# Altium schematic sheet MISC.SchDoc
size A4; SheetNumber: 2; SheetTotal: 2
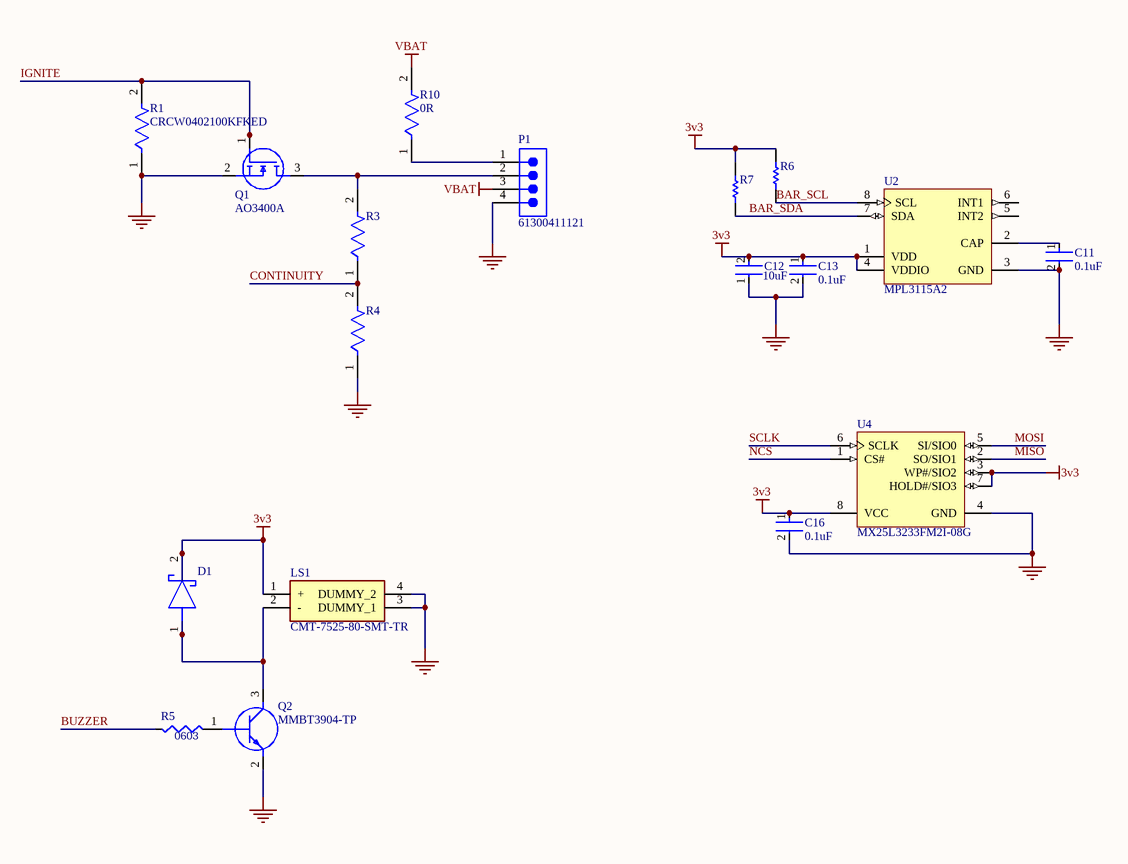
[diagram p0: MISC.SchDoc]

## Parts
C11  0.1uF  [FP-C0402-BB-MFG]
C12  10uF  [FP-C1608-080-0_1-MFG]
C13  0.1uF  [FP-C0402-BB-MFG]
C16  0.1uF  [FP-C0402-BB-MFG]
D1  RB161QS-40T18R  [RB161QS40T18R]  (value not drawn)
LS1  CMT-7525-80-SMT-TR  [CMT752580SMTTR]
P1  61300411121  [61300411121]
Q1  AO3400A  [SOT95P280X125-3N]
Q2  MMBT3904-TP  [SOT95P237X125-3N]
R1  CRCW0402100KFKED  [FP-CRCW0402-e3-IPC_C]
R3  CRCW0402100KFKED  [FP-CRCW0402-e3-IPC_C]  (value not drawn)
R4  CRCW040250K0FKED  [FP-CRCW0402-e3-IPC_A]  (value not drawn)
R5  ERJ-3EKF2000V  [R0603]  (value not drawn)
R6  RC0402JR-074K7L  [RESC1005X40X25LL05T10]  (value not drawn)
R7  RC0402JR-074K7L  [RESC1005X40X25LL05T10]  (value not drawn)
R10  0R  [FP-RK73Z1J-MFG]
U2  MPL3115A2  [FRES-2153-01_V]
U4  MX25L3233FM2I-08G  [MXIC-SOP-8_M]

## Nets
3v3: C12.2 C13.1 C16.1 D1.2(K) LS1.1(+) R6.2 R7.2 U2.1(VDD) U2.4(VDDIO) U4.3(WP#/SIO2) U4.7(HOLD#/SIO3) U4.8(VCC)
GND: C11.2 C12.1 C13.2 C16.2 LS1.3(DUMMY_1) LS1.4(DUMMY_2) P1.4 Q1.2(S) Q2.2(E) R1.1 R4.1 U2.3(GND) U4.4(GND)
VBAT: P1.3 R10.2
BAR_SCL: R6.1 U2.8(SCL)
BAR_SDA: R7.1 U2.7(SDA)
BUZZER: R5.1
CONTINUITY: R3.1 R4.2
IGNITE: Q1.1(G) R1.2
MISO: U4.2(SO/SIO1)
MOSI: U4.5(SI/SIO0)
NCS: U4.1(CS#)
SCLK: U4.6(SCLK)
NetC11_1: C11.1 U2.2(CAP)
NetD1_1: D1.1(A) LS1.2(-) Q2.3(C)
NetP1_1: P1.1 R10.1
NetP1_2: P1.2 Q1.3(D) R3.2
NetQ2_1: Q2.1(B) R5.2

Not connected (* = marked no-connect by the designer): U2 5(INT2) 6(INT1)

## Notes on the sheet
- (in symbol CMP-024-000031-1) 0603

## Library data of the parts
C11 C13 C16 = CMP-2008-02046-2: CAP CER 0.1UF 10V X5R 0402; Manufacturer: Kemet; Manufacturer Part Number: C0402C104K8PACTU; Material: Ceramic; Capacitance: 0.10 μF; Temperature Coefficient: 15%; Tolerance: 0.1; Value: 0.10 μF; Package: C0402-BB; Temperature: -55°C to +125°C; ComponentLink2Description: Datasheet; Temperature Characteristic: X5R; Device Class L1: Passive Components; Height: 0.55mm; Lead Free: Yes; ComponentLink2URL: https://content.kemet.com/datasheets/KEM_C1002_X7R_SMD.pdf; Device Class L2: Capacitors; Temperature Range Low: -55°C; Temperature Range High: +125°C; RoHS: TRUE; Octopart: https://octopart.com/c0402c104k8pactu-kemet-140039; Automotive: No; Mouser Description: Capacitor 100 nF 10 VDC 0402; Category: Cap; Voltage Rating: 10 V; Digikey Description: CAP CER 0.1UF 10V X5R 0402; Ipc Land Pattern Name: CAPC10050X50; Device Class L3: Ceramic Capacitors
C12 = CMP-2000-04979-3: Multilayer Ceramic Capacitors 10μF ±10% 10V X5R SMD 0603; Dielectric Material: Ceramic; Construction: Flat; Height: 0.8mm; Thickness: 0.035inch; Case Code (Metric): 1608; Radiation Hardening: No; Number of Pins: 2; Voltage Rating (DC): 10V; Depth: 0.8mm; Voltage: 10V; RoHS Compliant: Yes; Voltage Rating: 10V; Package Quantity: 1; Resistor Type: Ceramic; Termination: SMD/SMT; Lead Free: Lead Free; REACH SVHC: No SVHC; Tolerance: 10%; Mount: Surface Mount; Series: C; Packaging: Tape and Reel; Width: 0.8mm; Dielectric: X5R; Weight: 7.1E-05oz; Length: 1.6mm; Max Operating Temperature: 85°C; Case Code (Imperial): 0603; Case/Package: 0603; Min Operating Temperature: -55°C; Capacitance: 10uF
D1 = RB161QS-40T18R: Schottky Diode; Manufacturer_Name: ROHM Semiconductor; Datasheet Link: http://rohmfs.rohm.com/en/products/databook/datasheet/discrete/diode/schottky_barrier/rb161qs-40-e.pdf; Height: 0.24mm; Manufacturer_Part_Number: RB161QS-40T18R; Mouser Part Number: 755-RB161QS-40T18R; Mouser Price/Stock: https://www.mouser.co.uk/ProductDetail/ROHM-Semiconductor/RB161QS-40T18R?qs=r%2Fl4stf1ffr06ghBFd2HSg%3D%3D
LS1 = CMT-7525-80-SMT-TR: Loudspeaker or Buzzer; Manufacturer_Name: CUI Devices; Datasheet Link: https://www.cuidevices.com/product/resource/cmt-7525-80-smt-tr.pdf; Height: 2.7mm; Manufacturer_Part_Number: CMT-7525-80-SMT-TR; Mouser Part Number: 490-CMT-7525-80SMTTR; Mouser Price/Stock: https://www.mouser.co.uk/ProductDetail/CUI-Devices/CMT-7525-80-SMT-TR?qs=P1JMDcb91o5izP7Xira9ww%3D%3D; Arrow Part Number: CMT-7525-80-SMT-TR; Arrow Price/Stock: https://www.arrow.com/en/products/cmt-7525-80-smt-tr/cui-devices?region=nac
P1 = CMP-1502-01064-3: NexarPartId: 32855522; Operating Supply Voltage: 250V; Pitch: 2.54mm; Contact Resistance: 20mΩ; Number of Positions: 4; Current Rating: 3A; Connector Type: Male Pin; Gender: Male; Contact Plating: Gold; Height: 8.89mm; Lead Pitch: 2.54mm; Lead Free: Lead Free; Contact Mating Length: 5.9944mm; Number of Rows: 1; Termination: Solder; Packaging: Bulk; REACH SVHC: Unknown; Min Operating Temperature: -40°C; RoHS: Compliant; Number of Contacts: 4; Voltage Rating: 250V; Color: Black; Max Operating Temperature: 105°C; Contact Material: Copper; Mount: Through Hole; Orientation: Vertical; Number of Pins: 4
Q1 = AO3400A: MOSFET (N-Channel); Manufacturer_Name: Alpha & Omega Semiconductors; Datasheet Link: http://aosmd.com/res/data_sheets/AO3400A.pdf; Height: 1.25mm; Manufacturer_Part_Number: AO3400A; Arrow Part Number: AO3400A; Arrow Price/Stock: https://www.arrow.com/en/products/ao3400a/alpha-and-omega-semiconductor?utm_currency=USD&region=nac
Q2 = MMBT3904-TP: Transistor BJT NPN; Manufacturer_Name: MCC; Datasheet Link: https://mccsemi.com/pdf/Products/MMBT3904(SOT-23).pdf; Height: 1.25mm; Manufacturer_Part_Number: MMBT3904-TP; Mouser Part Number: 833-MMBT3904-TP; Mouser Price/Stock: https://www.mouser.co.uk/ProductDetail/Micro-Commercial-Components-MCC/MMBT3904-TP?qs=KFo7JewZbUHicjDjIayULQ%3D%3D; Arrow Part Number: MMBT3904-TP; Arrow Price/Stock: https://www.arrow.com/en/products/mmbt3904-tp/micro-commercial-components?region=nac
R1 R3 = CMP-2002-08123-3: RES Thick Film, 100kΩ, 1%, 0.063W, 100ppm/°C, 0402; Power Rating: 63mW; Resistance: 100kR; Voltage Rating (DC): 50V; Lead Free: Lead Free; Height: 0.35mm; Contact Plating: Tin; Min Operating Temperature: -55°C; Package Quantity: 10000; Case/Package: 0402; Temperature Coefficient: 100ppm/°C; Number of Terminations: 2; Packaging: Tape and Reel; Max Power Dissipation: 63mW; Case Code (Metric): 1005; Mount: Surface Mount; Width: 0.02inch; Termination: SMD/SMT; Length: 1mm; Number of Pins: 2; Weight: 2.3E-05oz; Radiation Hardening: No; Tolerance: 1%; Military Standard: Not; Features: Automotive AEC-Q200; Depth: 0.5mm; Composition: Thick Film; Max Operating Temperature: 155°C; Voltage Rating: 50V; Case Code (Imperial): 0402
R4 = CMP-02407-005152-1: RES Thick Film, 50kΩ, 1%, 0.063W, 100ppm/°C, 0402; Power Rating: 63mW; Voltage Rating: 50V; Resistance: 50kR; Package Quantity: 10000; Case/Package: 0402; Max Operating Temperature: 155°C; Case Code (Metric): 1005; Termination: SMD/SMT; Lead Free: Lead Free; Height: 0.35mm; Width: 0.5mm; Packaging: Tape and Reel; Min Operating Temperature: -55°C; Length: 1mm; Tolerance: 1%; Case Code (Imperial): 0402; Weight: 2.3E-05oz
R5 = CMP-024-000031-1: 200 OHM 1% 1/10W 0603; Made By: Brennan Swanton; Design Item ID: ERJ-3EKF2000V; Source: Resistors.SchLib; Reviewed By: *
R6 R7 = CMP-2002-08011-1: Manufacturer: Yageo / Phycomp; Part Number: RC0402JR-074K7L
R10 = CMP-2000-01769-2: RES 0 OHM JUMPER 0603; Resistance: 0mR; Power Rating: 1W; Tolerance: 1%; Temperature Coefficient: 400ppm/°C; Width: 0.8mm; Case/Package: 0603; RoHS Compliant: Yes; Min Operating Temperature: -55°C; Length: 1.6mm; Termination: SMD/SMT; Package Quantity: 5000; Packaging: Tape and Reel; Military Standard: Not; Series: RK73Z; Construction: Rectangular; Case Code (Metric): 1608; Resistor Type: Thick Film; Case Code (Imperial): 0603; Lead Free: Lead Free; Max Operating Temperature: 155°C; Depth: 0.8mm; Height: 0.45mm
U2 = CMP-1261-00002-2: Xtrinsic I2C Precision Altimeter, 1.95 to 3.6 V, -40 to 85 degC, 8-Pin LGA (2153-01), RoHS, Tray; Manufacturer: Freescale Semiconductor; fSCL@400 pF: 400 KHz Max.; VDDIO: 1.62 to 3.6 V; fSCL@20 pF: 4 MHz Max.; Operating Temperature Range: -40 to 85 degC; PackageDescription: 8-Pin Land Grid Array, Body 5 x 3 mm, Pitch 1.25 mm; Packing: Tray; ComponentLink1Description: Manufacturer URL; ComponentLink2Description: Datasheet; ComponentLink3URL: http://cache.freescale.com/files/shared/doc/package_info/98ASA00260D.pdf; RoHS: TRUE; Mounting Technology: Surface Mount; ComponentLink3Description: Package Specification; VDD: 1.95 to 3.6 V; ComponentLink1URL: http://www.freescale.com/; DatasheetVersion: Rev. 3.0; PartNumber: MPL3115A2; ComponentLink2URL: http://cache.freescale.com/files/sensors/doc/data_sheet/MPL3115A2.pdf; PackageVersion: Rev. O
U4 = CMP-2000-05278-1: CMOS MXSMIO(R) (Serial Multi I/O) Flash Memory, 32 Mbits (x1/x2/x4), 3 V, -40 to 85 degC, 8-Pin SOP; Manufacturer: Macronix; Manufacturer URL: http://www.macronix.com; Package Description: 8-Pin Small Outline Package, Body 5.23 x 5.28 mm, Pitch 1.27 mm; Datasheet URL: http://datasheet.octopart.com/MX25L3233FM2I-08G-Macronix-datasheet-38883555.pdf; Datasheet Version: Rev. 1.1, 01/2015; Package Reference: SOP-8